# EAGLE design tricorder-sensors-mk-1.0 (EAGLE 7.5.0)
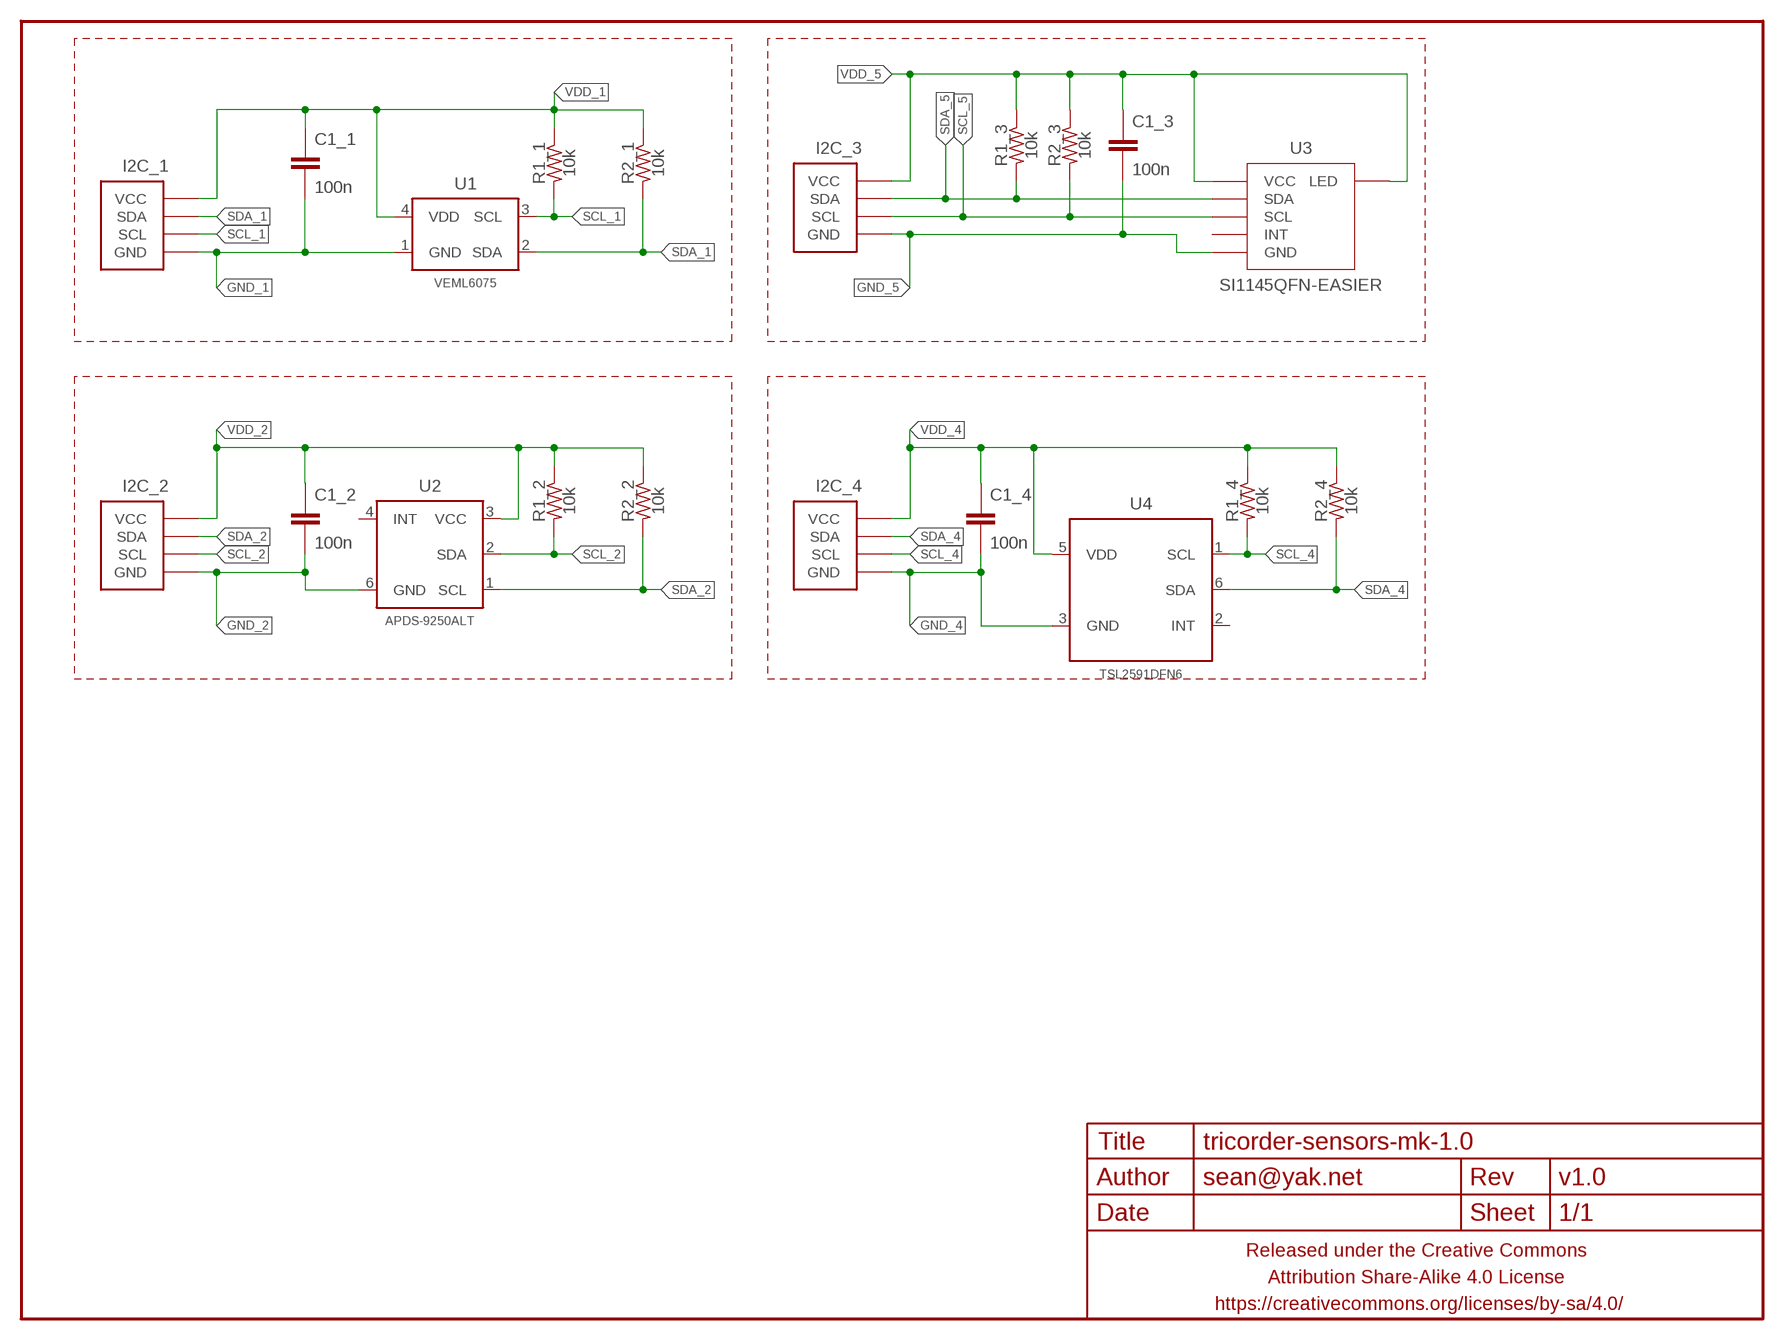
[diagram p0: schematic, sheet 1]

## Parts
C1_1  100n  CAPACITOR-CERAMICC0603  [C0603]
C1_2  100n  CAPACITOR-CERAMICC0603  [C0603]
C1_3  100n  CAPACITOR-CERAMICC0603  [C0603]
C1_4  100n  CAPACITOR-CERAMICC0603  [C0603]
FRAME1  FRAME-LETTERNO_PACKAGE  [DUMMY]
I2C_1  M04-I2CPTH-0.1IN-CENTERED  [1X04-PTH-VERT-I2C-CENTERED]
I2C_2  M04-I2CPTH-0.1IN-CENTERED  [1X04-PTH-VERT-I2C-CENTERED]
I2C_3  M04-I2CPTH-0.1IN-CENTERED  [1X04-PTH-VERT-I2C-CENTERED]
I2C_4  M04-I2CPTH-0.1IN-CENTERED  [1X04-PTH-VERT-I2C-CENTERED]
R1_1  10k  RESISTORR0603  [R0603]
R1_2  10k  RESISTORR0603  [R0603]
R1_3  10k  RESISTORR0603  [R0603]
R1_4  10k  RESISTORR0603  [R0603]
R2_1  10k  RESISTORR0603  [R0603]
R2_2  10k  RESISTORR0603  [R0603]
R2_3  10k  RESISTORR0603  [R0603]
R2_4  10k  RESISTORR0603  [R0603]
U1  VEML6075  [OPLGA4]
U2  APDS-9250ALT  [APDS-9250-ALT]
U3  SI1145QFN-EASIER  [SI1145-ALT]
U4  TSL2591DFN6  [TSL2951_DFN6]

## Nets
GND_1: C1_1.2 I2C_1.GND U1.1(GND)
GND_2: C1_2.2 I2C_2.GND U2.6(GND)
GND_4: C1_4.2 I2C_4.GND U4.3(GND)
GND_5: C1_3.2 I2C_3.GND U3.GND
SCL_1: I2C_1.SCL R1_1.2 U1.3(SCL)
SCL_2: I2C_2.SCL R1_2.2 U2.2(SDA)
SCL_4: I2C_4.SCL R1_4.2 U4.1(SCL)
SCL_5: I2C_3.SCL R2_3.2 U3.SCL
SDA_1: I2C_1.SDA R2_1.2 U1.2(SDA)
SDA_2: I2C_2.SDA R2_2.2 U2.1(SCL)
SDA_4: I2C_4.SDA R2_4.2 U4.6(SDA)
SDA_5: I2C_3.SDA R1_3.2 U3.SDA
VDD_1: C1_1.1 I2C_1.VCC R1_1.1 R2_1.1 U1.4(VDD)
VDD_2: C1_2.1 I2C_2.VCC R1_2.1 R2_2.1 U2.3(VCC)
VDD_4: C1_4.1 I2C_4.VCC R1_4.1 R2_4.1 U4.5(VDD)
VDD_5: C1_3.1 I2C_3.VCC R1_3.1 R2_3.1 U3.LED U3.VCC@1(VCC) U3.VCC@2(VCC)
Unconnected: U2.4(INT) U3.INT U4.2(INT)

## Library data of the parts
C1_1-C1_4 = a_parts:CAPACITOR-CERAMIC: CAPACITOR, European symbol
FRAME1 = a_parts:FRAME-LETTER: Schematic Frame Standard 8.5x11 US Letter frame; DESIGNER: sean@yak.net; VERSION: v1.0
I2C_1-I2C_4 = a_parts:M04-I2C
R1_1-R1_4 R2_1-R2_4 = a_parts:RESISTOR: RESISTOR, American symbol
U1 = a_parts:VEML6075
U2 = a_parts:APDS-9250
U3 = a_parts:SI1145
U4 = a_parts:TSL2591

## Module SENSOR_VEML6075
Ports: 

### Library data of the parts

## Board
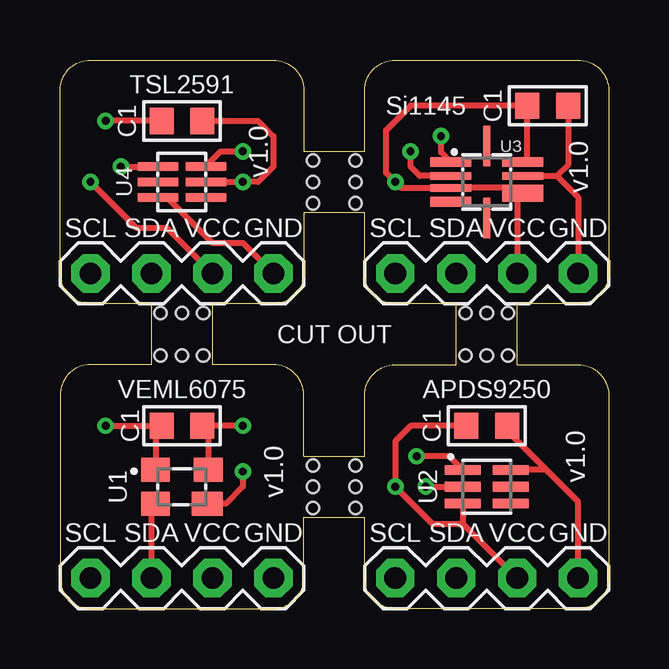
[diagram p1: board, top side]
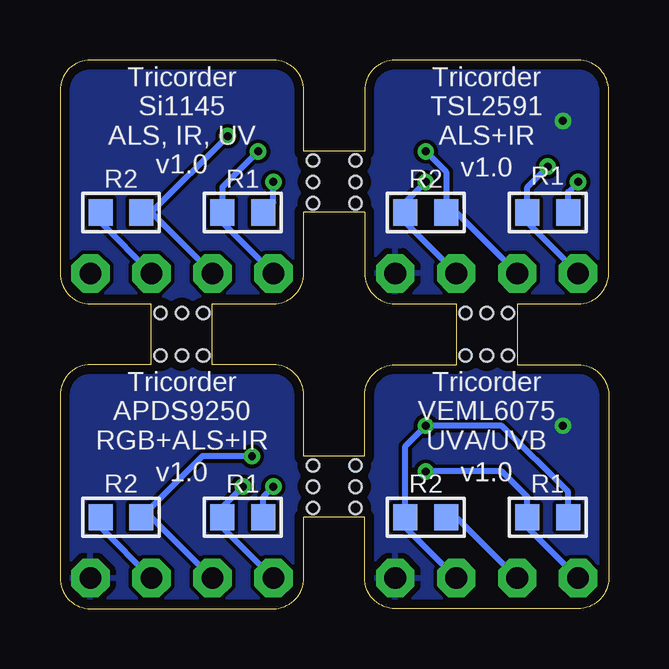
[diagram p2: board, bottom side, seen from below]

Size 22.86 x 22.86 mm. Coordinates in mm from the lower left corner, seen from the top.
Outline: 3.81,10.16 1.27,10.16 arc90 0,8.89 0,1.27 arc90 1.27,0 8.89,0 arc90 10.16,1.27 10.16,3.81 12.7,3.81 12.7,1.27 arc90 13.97,0 21.59,0 arc90 22.86,1.27 22.86,8.89 arc90 21.59,10.16 19.05,10.16 19.05,12.7 21.59,12.7 arc90 22.86,13.97 22.86,21.59 arc90 21.59,22.86 13.97,22.86 arc90 12.7,21.59 12.7,19.05 10.16,19.05 10.16,21.59 arc90 8.89,22.86 1.27,22.86 arc90 0,21.59 0,13.97 arc90 1.27,12.7 3.81,12.7 3.81,10.16
Outline: 10.16,6.35 10.16,8.89 arc90 8.89,10.16 6.35,10.16 6.35,12.7 8.89,12.7 arc90 10.16,13.97 10.16,16.51 12.7,16.51 12.7,13.97 arc90 13.97,12.7 16.51,12.7 16.51,10.16 13.97,10.16 arc90 12.7,8.89 12.7,6.35 10.16,6.35
Copper layers (1*16): Top 0.0356mm / dielectric 1.5011mm / Bottom 0.0356mm
Design rules "LaenPCBOrder2": minimum track width 6mil, minimum drill 13mil, track to track 6mil, track to pad 6mil, pad to pad 6mil, via to via 6mil, smd to smd 6mil, copper to edge 15mil, drill to drill 6mil, minimum pad ring 7mil, minimum via ring 7mil, stop-mask expansion 3mil, vias tented up to drill 20mil, thermal gap 10mil
Holes 0.51 mm at 5.08,12.32 4.19,12.32 5.97,12.32 4.19,10.54 5.08,10.54 5.97,10.54 10.54,5.08 10.54,4.19 10.54,5.97 12.32,4.19 12.32,5.08 12.32,5.97 10.54,17.78 10.54,16.89 10.54,18.67 12.32,16.89 12.32,17.78 12.32,18.67 17.78,10.54 18.67,10.54 16.89,10.54 18.67,12.32 17.78,12.32 16.89,12.32

### Footprints (pad centres in the part's own frame; a part is rotated, then mirrored left to right if it is on the bottom)
C0603 = smd 1 x 1.1: 1 -0.85,0; 2 0.85,0
1X04-PTH-VERT-I2C-CENTERED = drill 0.9 pad 1.6 octagon: GND -3.81,0; SCL 3.81,0; SDA 1.27,0; VCC -1.27,0
R0603 = smd 1 x 1.1: 1 -0.85,0; 2 0.85,0
OPLGA4 = smd 1.2 x 1: 1 -1.1,0.7; 2 -1.1,-0.7; 4 1.1,0.7 | smd 1.3 x 1: 3 1.05,-0.7
APDS-9250-ALT = smd 1.5 x 0.4: 1 -1,0.7; 2 -1,0; 3 -1,-0.7; 4 1,-0.7; 5 1,0; 6 1,0.7
SI1145-ALT = smd 1.7 x 0.3: GND 1.5,0.25; SCL -1.5,0.25; VCC@1 -1.5,-0.25 | smd 1.7 x 0.4: INT -1.5,-0.825; LED 1.5,0.825; SDA -1.5,0.825 | smd 0.3 x 1.7: NC@1 0,1.5; NC@2 0,-1.5 | smd 1.7 x 0.7: VCC@2 1.5,-0.475
TSL2951_DFN6 = smd 1.7 x 0.35: 1 -1,0.65; 2 -1,0; 3 -1,-0.65; 4 1,-0.65; 5 1,0; 6 1,0.65

### Placement (x,y rotation side)
C1_1  5.08,7.62 180 top
C1_2  17.78,7.62 0 top
C1_3  20.32,20.95 0 top
C1_4  5.08,20.32 180 top
FRAME1  0,0 0 top
I2C_1  5.08,1.27 180 top
I2C_2  17.78,1.27 180 top
I2C_3  17.78,13.97 180 top
I2C_4  5.08,13.97 180 top
R1_1  2.54,3.81 180 bottom
R1_2  15.24,3.81 180 bottom
R1_3  20.32,16.51 0 bottom
R1_4  2.54,16.51 180 bottom
R2_1  7.62,3.81 0 bottom
R2_2  20.32,3.81 0 bottom
R2_3  15.24,16.51 180 bottom
R2_4  7.62,16.51 0 bottom
U1  5.08,5.08 0 top
U2  17.78,5.08 0 top
U3  17.78,17.78 0 top
U4  5.08,17.78 0 top

### Tracks (layer width: path | path; a pad name or v marks a point on that pad's centre or on a via)
GND_1  (via drill 0.33)
  Top 0.254: U1.1 3.98,7.37 C1_1.2 v1.91,7.62
  pour Bottom: 10.16,1.27 10.16,8.89 arc90 8.89,10.16 1.27,10.16 arc90 0,8.89 0,1.27 arc90 1.27,0 8.89,0 arc90
GND_2
  Top 0.254: I2C_2.GND 21.59,4.45 20.32,5.71 20.25,5.78 | 20.25,5.78 U2.6 | C1_2.2 18.63,7.41 20.25,5.78
  pour Bottom: 12.7,8.89 12.7,1.27 arc90 13.97,0 21.59,0 arc90 22.86,1.27 22.86,8.89 arc90 21.59,10.16 13.97,10.16 arc90
GND_3
  pour Bottom: 21.59,22.86 13.97,22.86 arc90 12.7,21.59 12.7,13.97 arc90 13.97,12.7 21.59,12.7 arc90 22.86,13.97 22.86,21.59 arc90
GND_4  (via drill 0.33)
  Top 0.254: U4.3 4.46,17.13 6.35,15.24 7.62,15.24 I2C_4.GND | C1_4.2 v1.91,20.32
  pour Bottom: 0,21.59 0,13.97 arc90 1.27,12.7 8.89,12.7 arc90 10.16,13.97 10.16,21.59 arc90 8.89,22.86 1.27,22.86 arc90
GND_5
  Top 0.254: U3.GND 20.7,18.03 | 20.7,18.03 21.59,17.14 I2C_3.GND | C1_3.2 21.17,18.5 20.7,18.03
SCL_1  (via drill 0.33)
  Top 0.254: v7.62,5.71 7.62,5.08 6.92,4.38 U1.3
  Bottom 0.254: I2C_1.SCL 3.39,3.39 R1_1.2 3.39,4.66 4.45,5.71 v7.62,5.71
SCL_2  (via drill 0.33)
  Top 0.254: v15.24,5.08 U2.2
  Bottom 0.254: I2C_2.SCL 16.09,3.39 R1_2.2 16.09,4.23 v15.24,5.08
SCL_4  (via drill 0.33)
  Top 0.254: v2.54,18.41 4.07,18.41 U4.1
  Bottom 0.254: I2C_4.SCL 3.39,16.09 R1_4.2 3.39,17.57 v2.54,18.41
SCL_5  (via drill 0.33)
  Top 0.254: U3.SCL 14.99,18.03 14.61,18.41 v14.61,19.05
  Bottom 0.254: I2C_3.SCL 16.09,16.09 R2_3.2 16.09,17.57 v14.61,19.05
SDA_1
  Top 0.254: U1.2 3.81,4.21 I2C_1.SDA
  Bottom 0.254: I2C_1.SDA 6.35,3.81 R2_1.2
SDA_2  (via drill 0.33)
  Top 0.254: U2.1 16.21,6.35 v14.86,6.35
  Bottom 0.254: I2C_2.SDA 19.05,3.81 R2_2.2 16.93,6.35 v14.86,6.35
SDA_4  (via drill 0.33)
  Top 0.254: U4.6 6.7,19.05 v7.62,19.05
  Bottom 0.254: I2C_4.SDA 6.35,16.51 R2_4.2 6.77,18.2 v7.62,19.05
SDA_5  (via drill 0.33)
  Top 0.254: U3.SDA 15.88,19.01 v15.88,19.68
  Bottom 0.254: I2C_3.SDA 19.05,16.51 | v15.88,19.68 19.05,16.51 | 19.05,16.51 R1_3.2
VDD_1  (via drill 0.33)
  Top 0.254: v7.62,7.62 C1_1.1 6.18,7.37 U1.4
  Bottom 0.254: I2C_1.VCC 8.47,3.39 R2_1.1 8.47,6.77 v7.62,7.62 4.45,7.62 1.69,4.87 R1_1.1
VDD_2  (via drill 0.33)
  Top 0.254: U2.3 16.78,3.54 | 16.78,3.54 I2C_2.VCC | 16.78,3.54 15.51,3.54 v13.97,5.08 13.97,6.99 14.61,7.62 C1_2.1
  Bottom 0.254: I2C_2.VCC 21.17,3.39 R2_2.1 | R1_2.1 14.39,4.66 v13.97,5.08
VDD_4  (via drill 0.33)
  Top 0.254: v1.27,17.78 3.17,15.88 4.45,15.88 I2C_4.VCC | U4.5 v7.62,17.78 8.26,17.78 8.89,18.41 8.89,19.68 8.26,20.32 C1_4.1
  Bottom 0.254: I2C_4.VCC 8.47,16.09 R2_4.1 8.47,16.93 v7.62,17.78 | R1_4.1 1.69,17.36 v1.27,17.78
VDD_5  (via drill 0.33)
  Top 0.254: I2C_3.VCC 19.05,17.07 U3.VCC@2 19.05,17.53 U3.VCC@1 14.22,17.53 v13.97,17.78 13.59,18.16 13.59,19.94 14.61,20.95 C1_3.1 19.47,18.8 U3.LED
  Bottom 0.254: I2C_3.VCC 21.17,16.09 R1_3.1 | R2_3.1 13.97,16.93 v13.97,17.78

### Text on the board
tPlace: TSL2591 | Si1145 | CUT OUT | VEML6075 | APDS9250
bPlace: Tricorder / TSL2591 / ALS+IR | Tricorder / Si1145 / ALS, IR, UV | Tricorder / VEML6075 / UVA/UVB | Tricorder / APDS9250 / RGB+ALS+IR
tNames: C1 | C1 | C1 | C1
bNames: R1 | R2 | R1 | R2 | R1 | R2 | R1 | R2